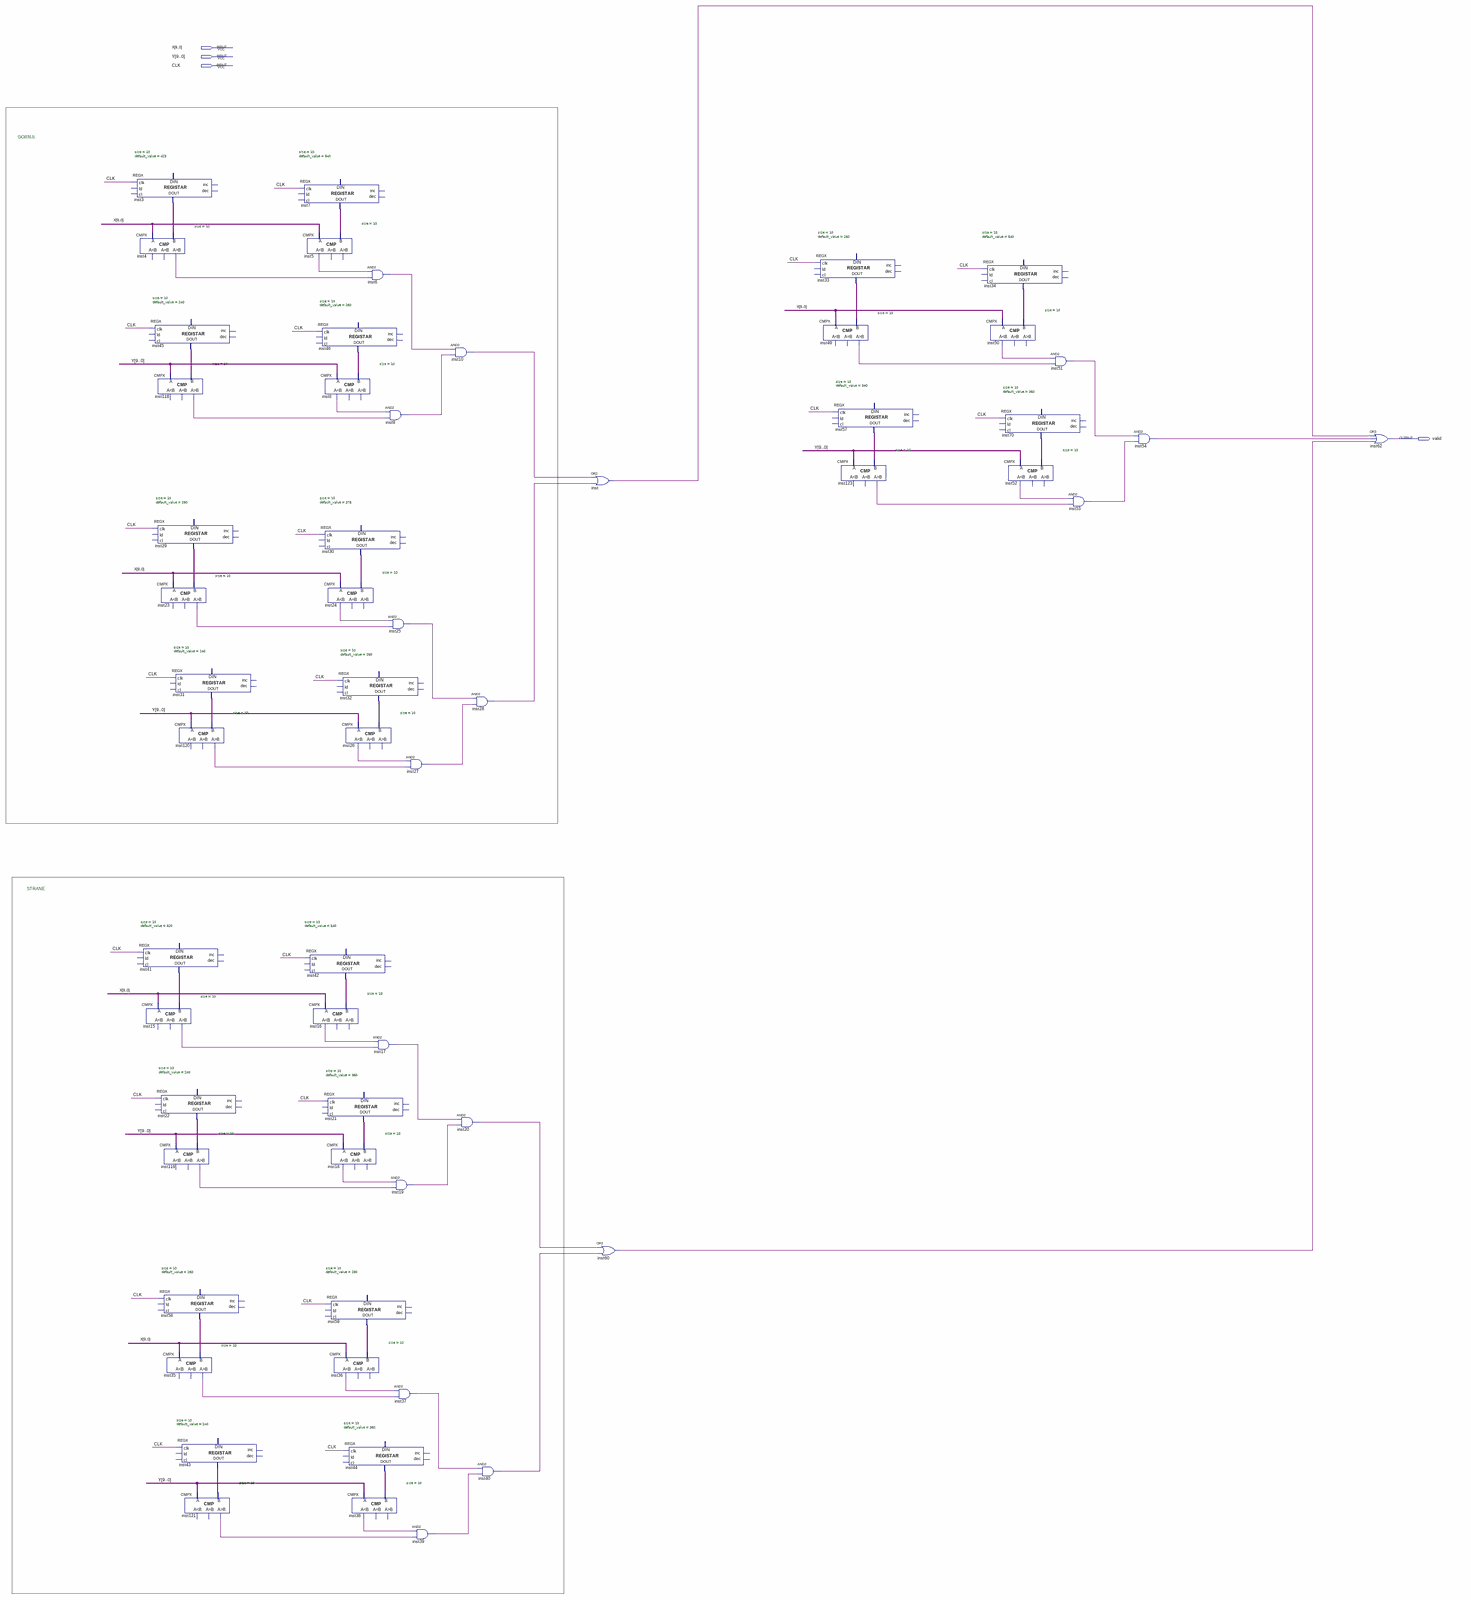
[diagram p0: schematic sheet, whole]
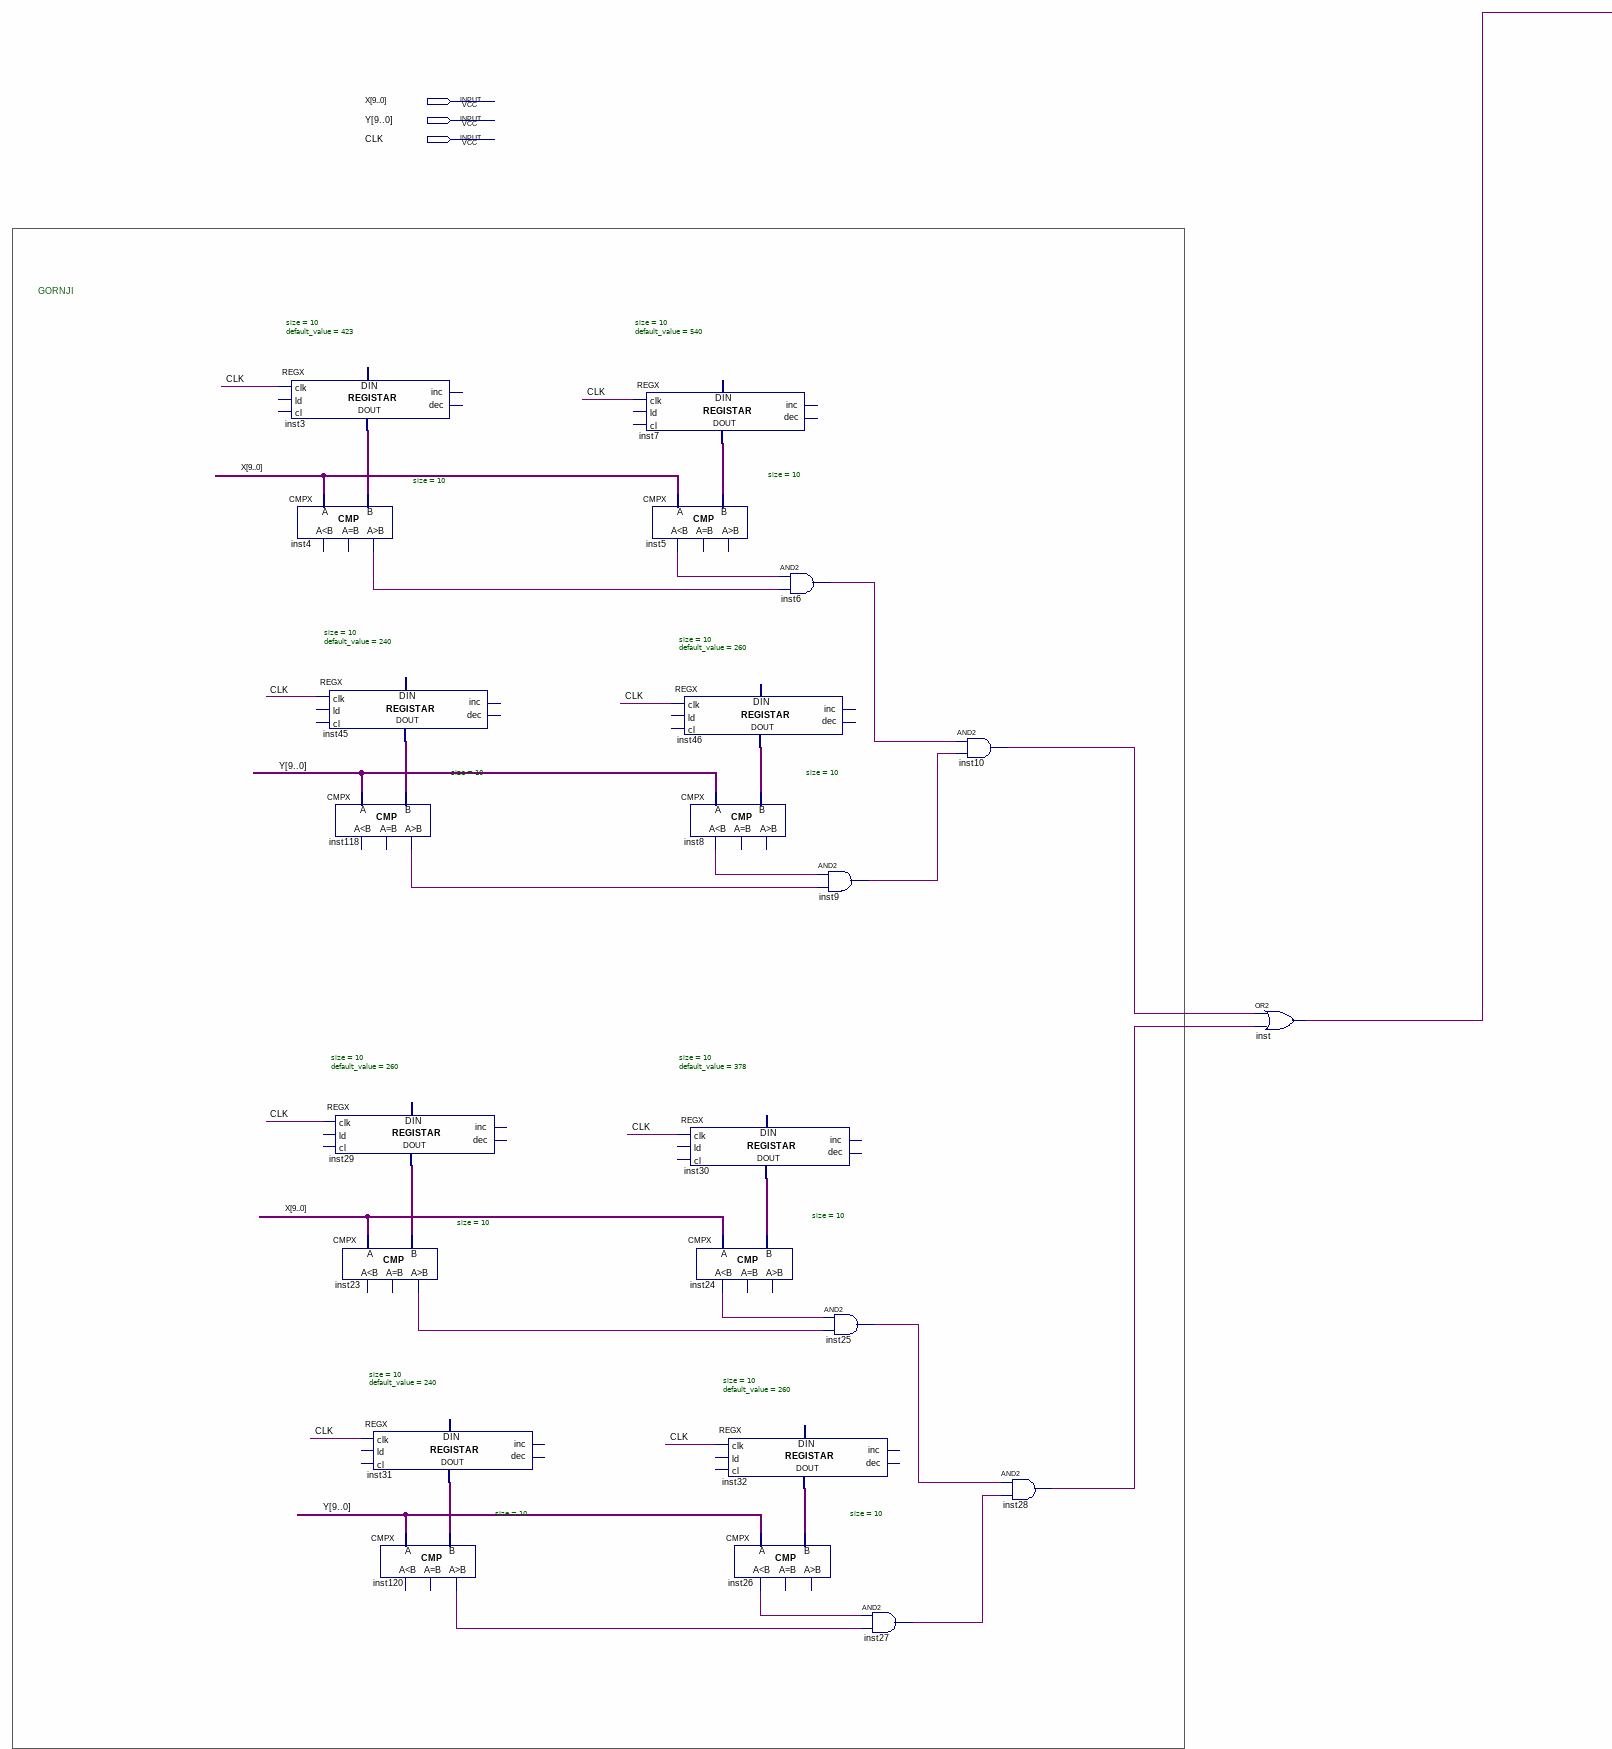
[diagram p1: schematic sheet, upper left part]
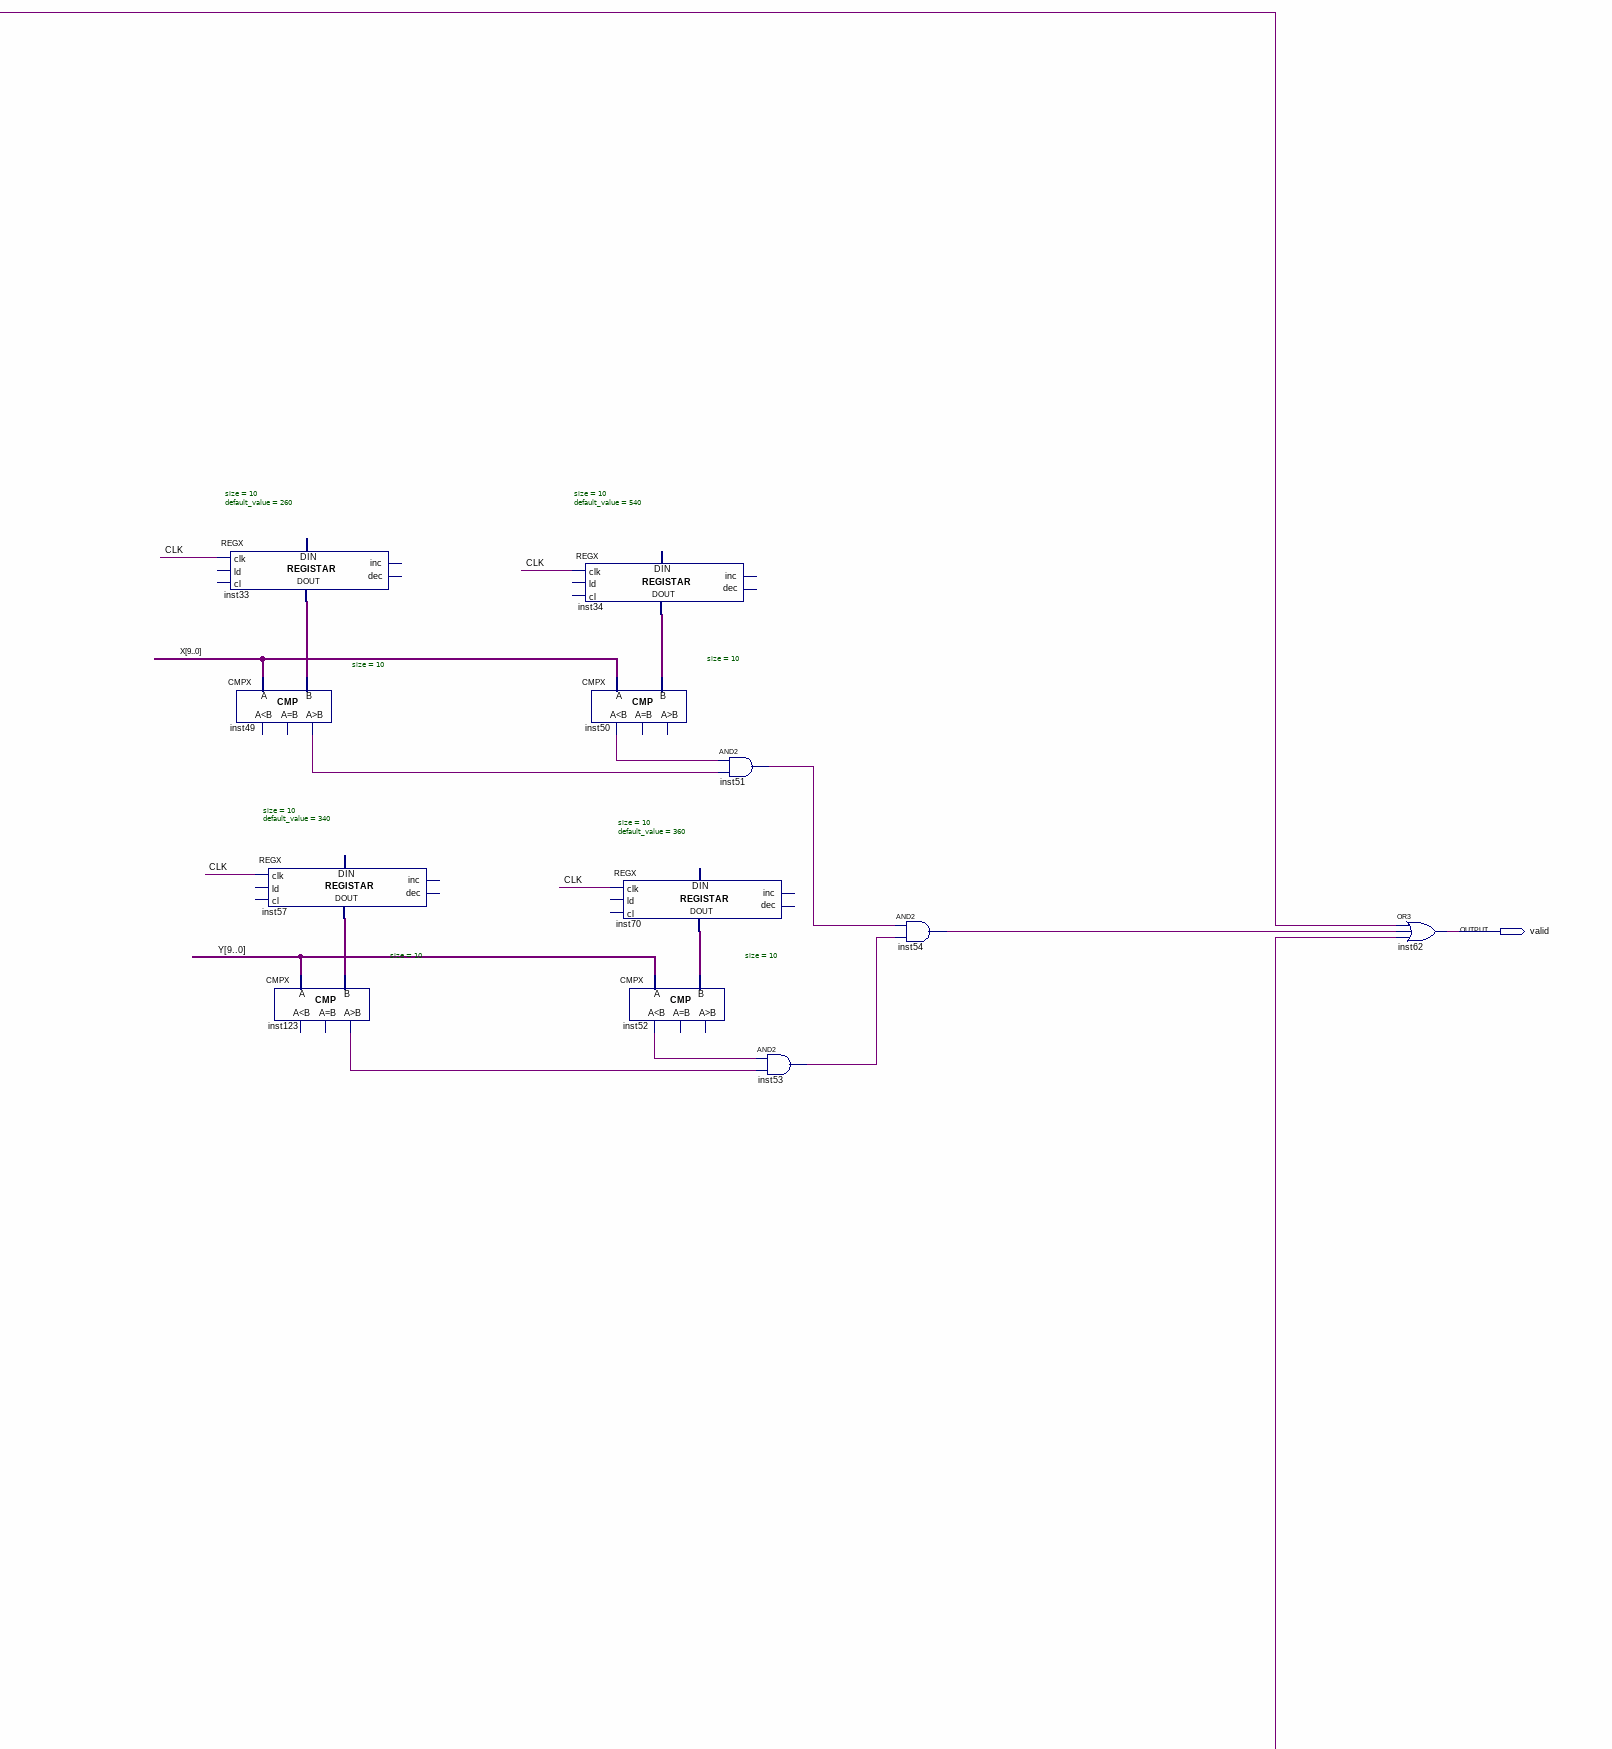
[diagram p2: schematic sheet, upper right part]
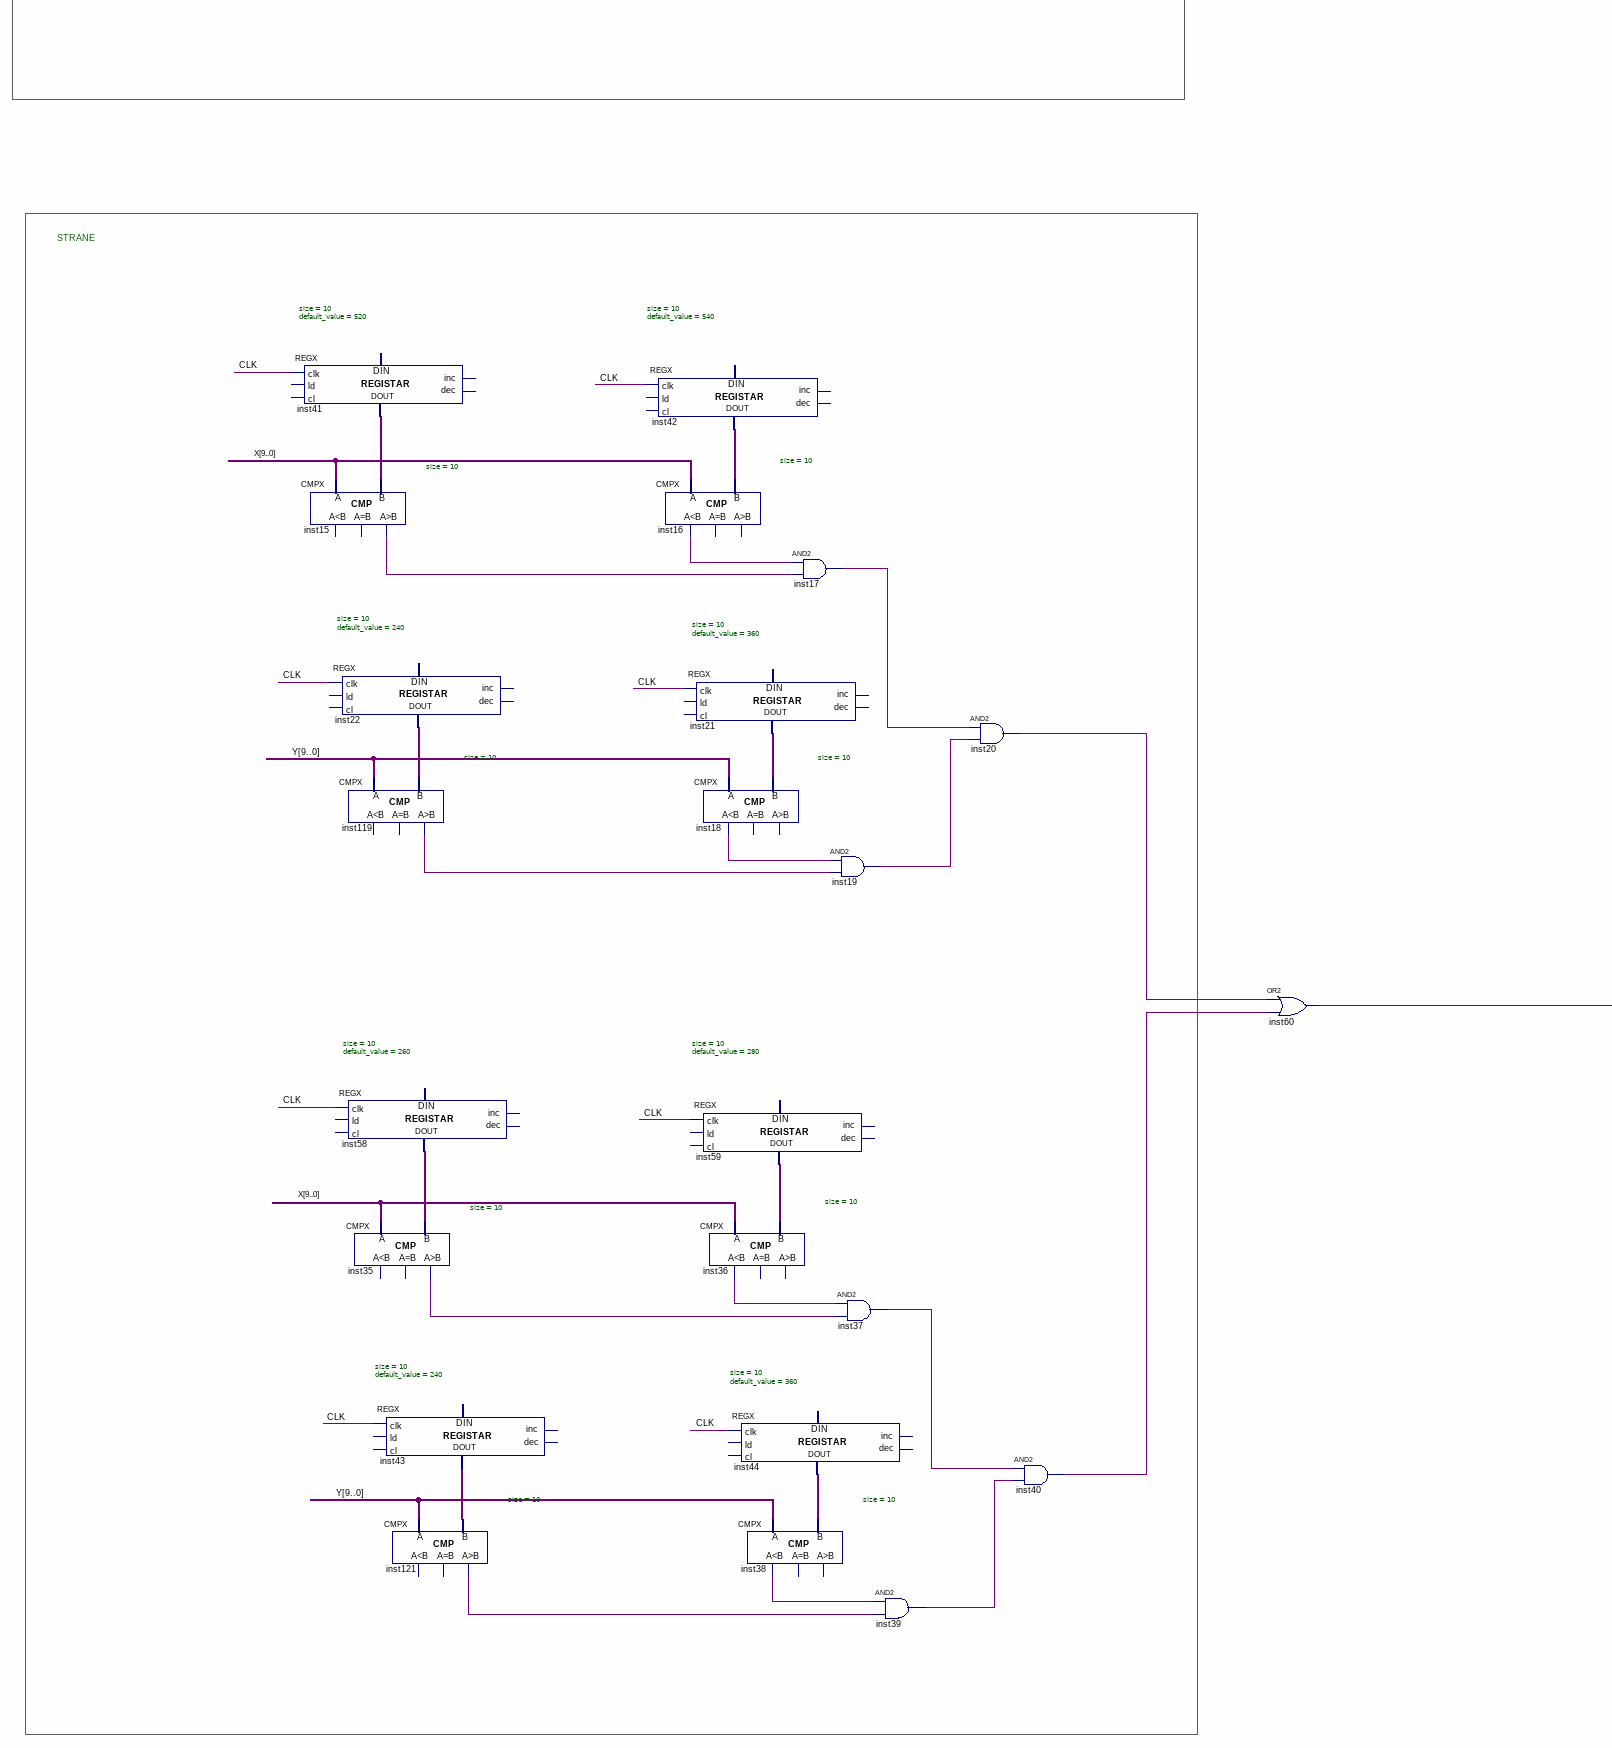
[diagram p3: schematic sheet, lower left part]
// Quartus schematic kucica.bdf as structural Verilog: 58 symbols, 4 pins
module kucica (
  input  [9:0] X,
  input  [9:0] Y,
  input  CLK,
  output valid
);

  wire inst4_gr, inst5_ls, inst6_out, inst8_ls, inst9_out, inst10_out, inst15_gr, inst16_ls, inst17_out,
       inst18_ls, inst19_out, inst20_out, inst23_gr, inst24_ls, inst25_out, inst26_ls, inst27_out,
       inst28_out, inst35_gr, inst36_ls, inst37_out, inst38_ls, inst39_out, inst40_out, inst49_gr, inst50_ls,
       inst51_out, inst52_ls, inst53_out, inst54_out, inst60_out, inst118_gr, inst119_gr, inst120_gr,
       inst121_gr, inst123_gr, inst_out;
  wire [9:0] inst3_data_out, inst7_data_out, inst21_data_out, inst22_data_out, inst29_data_out,
       inst30_data_out, inst31_data_out, inst32_data_out, inst33_data_out, inst34_data_out, inst41_data_out,
       inst42_data_out, inst43_data_out, inst44_data_out, inst45_data_out, inst46_data_out, inst57_data_out,
       inst58_data_out, inst59_data_out, inst70_data_out;

  REGX #(.size(10), .default_value(423)) inst3 (
    .clk(CLK), .data_out(inst3_data_out));  // open: ld, cl, inc, dec, data_in
  CMPX #(.size(10)) inst4 (.A(X), .B(inst3_data_out), .gr(inst4_gr));  // open: ls, eq
  REGX #(.size(10), .default_value(520)) inst41 (
    .clk(CLK), .data_out(inst41_data_out));  // open: ld, cl, inc, dec, data_in
  CMPX #(.size(10)) inst15 (.A(X), .B(inst41_data_out), .gr(inst15_gr));  // open: ls, eq
  REGX #(.size(10), .default_value(240)) inst45 (
    .clk(CLK), .data_out(inst45_data_out));  // open: ld, cl, inc, dec, data_in
  CMPX #(.size(10)) inst118 (.A(Y), .B(inst45_data_out), .gr(inst118_gr));  // open: ls, eq
  REGX #(.size(10), .default_value(260)) inst29 (
    .clk(CLK), .data_out(inst29_data_out));  // open: ld, cl, inc, dec, data_in
  CMPX #(.size(10)) inst23 (.A(X), .B(inst29_data_out), .gr(inst23_gr));  // open: ls, eq
  REGX #(.size(10), .default_value(240)) inst22 (
    .clk(CLK), .data_out(inst22_data_out));  // open: ld, cl, inc, dec, data_in
  CMPX #(.size(10)) inst119 (.A(Y), .B(inst22_data_out), .gr(inst119_gr));  // open: ls, eq
  REGX #(.size(10), .default_value(260)) inst58 (
    .clk(CLK), .data_out(inst58_data_out));  // open: ld, cl, inc, dec, data_in
  CMPX #(.size(10)) inst35 (.A(X), .B(inst58_data_out), .gr(inst35_gr));  // open: ls, eq
  REGX #(.size(10), .default_value(240)) inst31 (
    .clk(CLK), .data_out(inst31_data_out));  // open: ld, cl, inc, dec, data_in
  CMPX #(.size(10)) inst120 (.A(Y), .B(inst31_data_out), .gr(inst120_gr));  // open: ls, eq
  REGX #(.size(10), .default_value(240)) inst43 (
    .clk(CLK), .data_out(inst43_data_out));  // open: ld, cl, inc, dec, data_in
  CMPX #(.size(10)) inst121 (.A(Y), .B(inst43_data_out), .gr(inst121_gr));  // open: ls, eq
  REGX #(.size(10), .default_value(540)) inst7 (
    .clk(CLK), .data_out(inst7_data_out));  // open: ld, cl, inc, dec, data_in
  CMPX #(.size(10)) inst5 (.A(X), .B(inst7_data_out), .ls(inst5_ls));  // open: eq, gr
  REGX #(.size(10), .default_value(540)) inst42 (
    .clk(CLK), .data_out(inst42_data_out));  // open: ld, cl, inc, dec, data_in
  CMPX #(.size(10)) inst16 (.A(X), .B(inst42_data_out), .ls(inst16_ls));  // open: eq, gr
  REGX #(.size(10), .default_value(260)) inst46 (
    .clk(CLK), .data_out(inst46_data_out));  // open: ld, cl, inc, dec, data_in
  CMPX #(.size(10)) inst8 (.A(Y), .B(inst46_data_out), .ls(inst8_ls));  // open: eq, gr
  REGX #(.size(10), .default_value(378)) inst30 (
    .clk(CLK), .data_out(inst30_data_out));  // open: ld, cl, inc, dec, data_in
  CMPX #(.size(10)) inst24 (.A(X), .B(inst30_data_out), .ls(inst24_ls));  // open: eq, gr
  REGX #(.size(10), .default_value(360)) inst21 (
    .clk(CLK), .data_out(inst21_data_out));  // open: ld, cl, inc, dec, data_in
  CMPX #(.size(10)) inst18 (.A(Y), .B(inst21_data_out), .ls(inst18_ls));  // open: eq, gr
  REGX #(.size(10), .default_value(280)) inst59 (
    .clk(CLK), .data_out(inst59_data_out));  // open: ld, cl, inc, dec, data_in
  CMPX #(.size(10)) inst36 (.A(X), .B(inst59_data_out), .ls(inst36_ls));  // open: eq, gr
  REGX #(.size(10), .default_value(260)) inst32 (
    .clk(CLK), .data_out(inst32_data_out));  // open: ld, cl, inc, dec, data_in
  CMPX #(.size(10)) inst26 (.A(Y), .B(inst32_data_out), .ls(inst26_ls));  // open: eq, gr
  REGX #(.size(10), .default_value(360)) inst44 (
    .clk(CLK), .data_out(inst44_data_out));  // open: ld, cl, inc, dec, data_in
  CMPX #(.size(10)) inst38 (.A(Y), .B(inst44_data_out), .ls(inst38_ls));  // open: eq, gr
  and inst6 (inst6_out, inst5_ls, inst4_gr);
  and inst17 (inst17_out, inst16_ls, inst15_gr);
  and inst9 (inst9_out, inst8_ls, inst118_gr);
  and inst25 (inst25_out, inst24_ls, inst23_gr);
  and inst19 (inst19_out, inst18_ls, inst119_gr);
  and inst37 (inst37_out, inst36_ls, inst35_gr);
  and inst27 (inst27_out, inst26_ls, inst120_gr);
  and inst39 (inst39_out, inst38_ls, inst121_gr);
  and inst10 (inst10_out, inst6_out, inst9_out);
  and inst28 (inst28_out, inst25_out, inst27_out);
  and inst20 (inst20_out, inst17_out, inst19_out);
  and inst40 (inst40_out, inst37_out, inst39_out);
  or inst (inst_out, inst10_out, inst28_out);
  or inst60 (inst60_out, inst20_out, inst40_out);
  REGX #(.size(10), .default_value(260)) inst33 (
    .clk(CLK), .data_out(inst33_data_out));  // open: ld, cl, inc, dec, data_in
  CMPX #(.size(10)) inst49 (.A(X), .B(inst33_data_out), .gr(inst49_gr));  // open: ls, eq
  REGX #(.size(10), .default_value(340)) inst57 (
    .clk(CLK), .data_out(inst57_data_out));  // open: ld, cl, inc, dec, data_in
  CMPX #(.size(10)) inst123 (.A(Y), .B(inst57_data_out), .gr(inst123_gr));  // open: ls, eq
  REGX #(.size(10), .default_value(540)) inst34 (
    .clk(CLK), .data_out(inst34_data_out));  // open: ld, cl, inc, dec, data_in
  CMPX #(.size(10)) inst50 (.A(X), .B(inst34_data_out), .ls(inst50_ls));  // open: eq, gr
  REGX #(.size(10), .default_value(360)) inst70 (
    .clk(CLK), .data_out(inst70_data_out));  // open: ld, cl, inc, dec, data_in
  CMPX #(.size(10)) inst52 (.A(Y), .B(inst70_data_out), .ls(inst52_ls));  // open: eq, gr
  and inst51 (inst51_out, inst50_ls, inst49_gr);
  and inst53 (inst53_out, inst52_ls, inst123_gr);
  and inst54 (inst54_out, inst51_out, inst53_out);
  or inst62 (valid, inst_out, inst54_out, inst60_out);

  // Notes on the sheet:
  //   GORNJI
  //   STRANE
endmodule
